# EAGLE design sensnode (EAGLE 5.11)
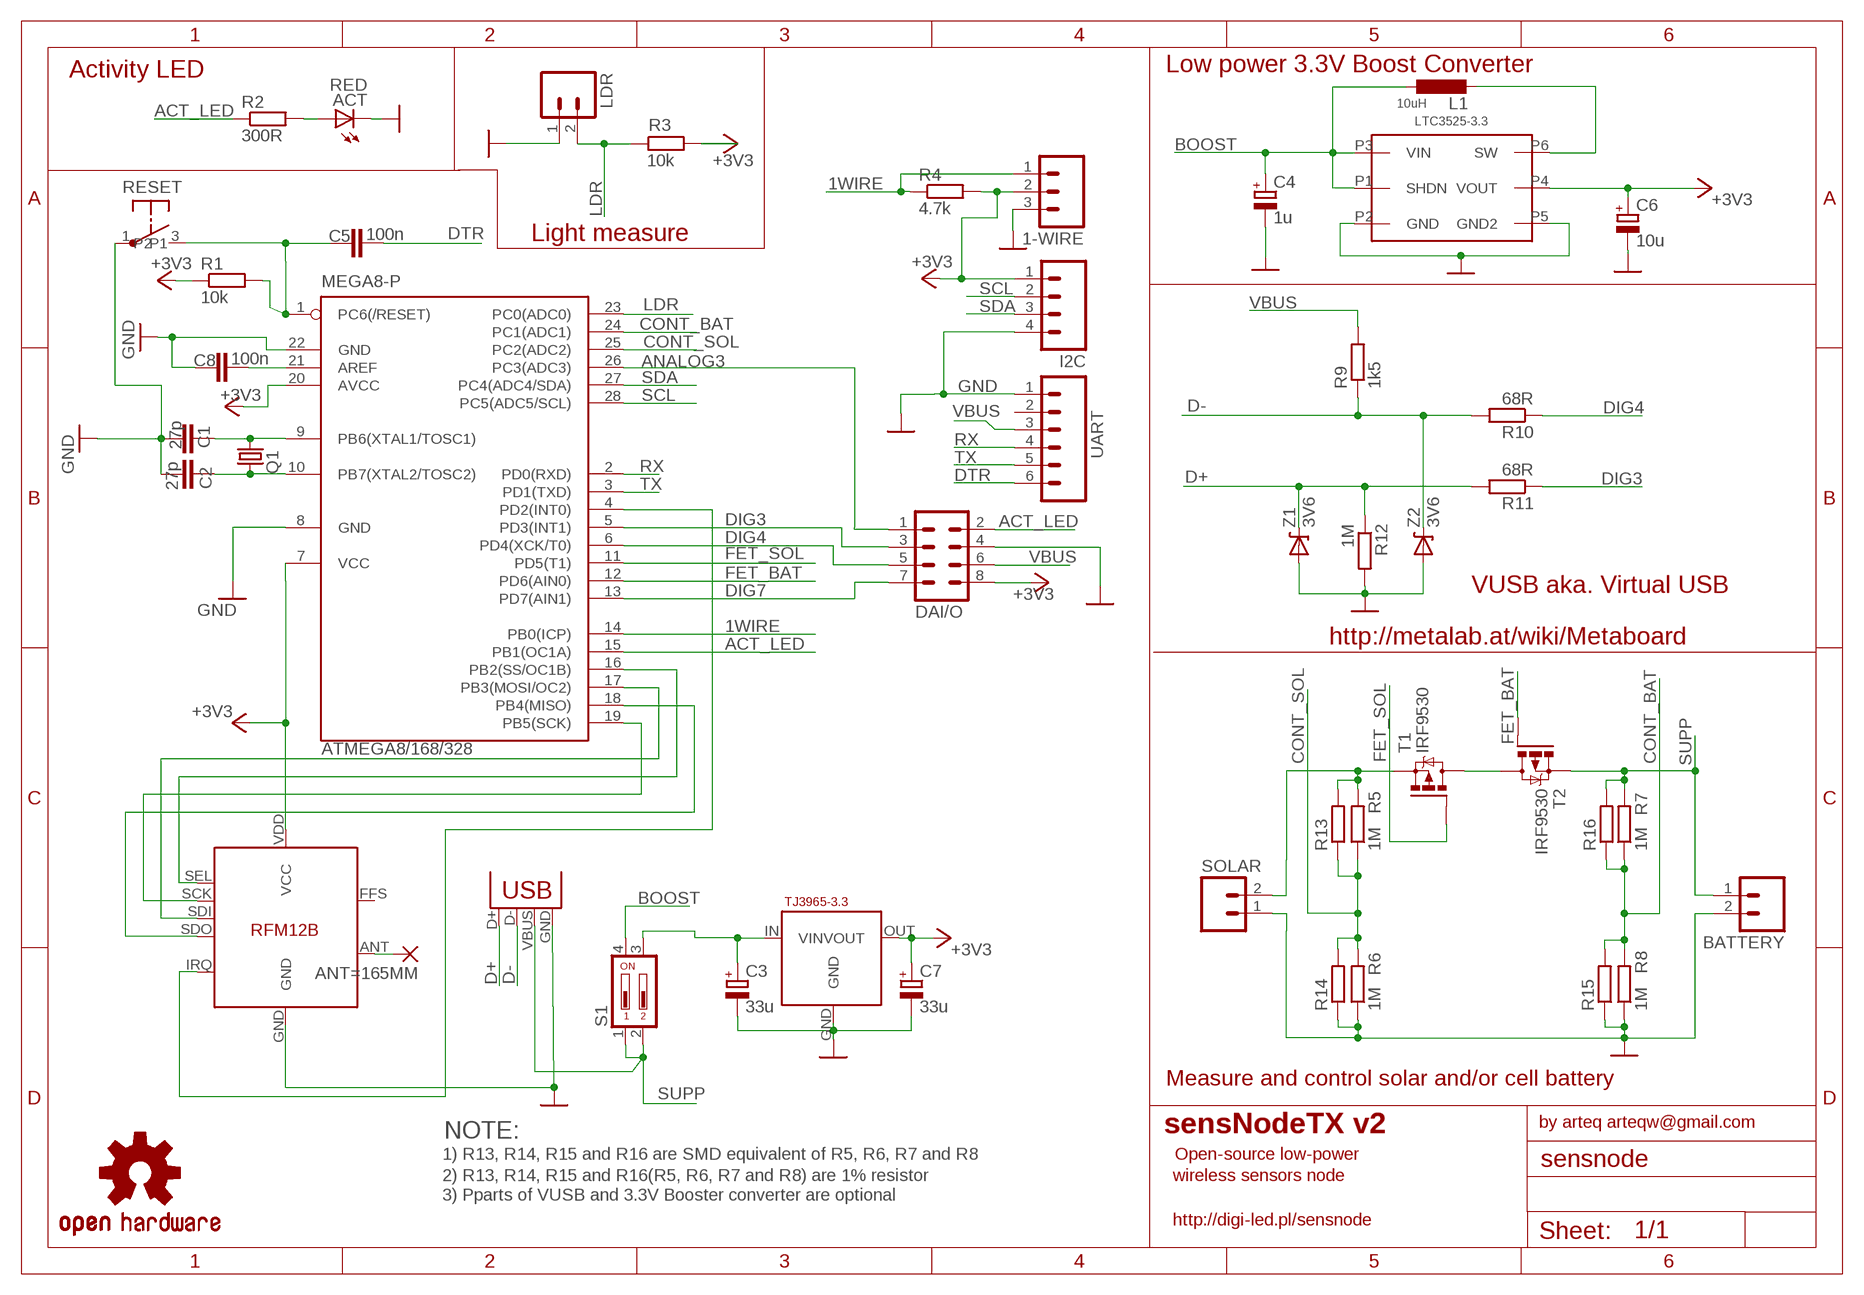
[diagram p0: schematic, sheet 1]

## Parts
1-WIRE  M03PTH  [1X03]
3.3V  TJ3965-3.3  [SOT223]
ACT  RED  LED3MM  [LED3MM]
ANT=165MM  1,6/0,8  [1,6/0,8]
ATMEGA8/168/328  MEGA8-P  [DIL28-3]
BATTERY  M02PTH  [1X02]
C1  27p  C2.5/2  [C2.5-2]
C2  27p  C2.5/2  [C2.5-2]
C3  33u  CPOL-EUSMCB  [SMC_B]
C4  1u  CPOL-EUSMCA  [SMC_A]
C5  100n  C2.5/2  [C2.5-2]
C6  10u  CPOL-EUSMCA  [SMC_A]
C7  33u  CPOL-EUSMCB  [SMC_B]
C8  100n  C2.5/2  [C2.5-2]
I2C  M04PTH  [1X04]
L1  L-EU0207/10  [0207/10]
LDR  M02PTH  [1X02]
Q1  CRYSTALHC49U70  [HC49U70]
R1  10k  R-EU_0204/7  [0204/7]
R2  300R  R-EU_0204/7  [0204/7]
R3  10k  R-EU_0204/7  [0204/7]
R4  4.7k  R-EU_0204/7  [0204/7]
R5  1M  R-EU_0204/7  [0204/7]
R6  1M  R-EU_0204/7  [0204/7]
R7  1M  R-EU_0204/7  [0204/7]
R8  1M  R-EU_0204/7  [0204/7]
R9  1k5  R-EU_0204/7  [0204/7]
R10  68R  R-EU_0204/7  [0204/7]
R11  68R  R-EU_0204/7  [0204/7]
R12  1M  R-EU_0204/7  [0204/7]
R13  R-EU_M0805  [M0805]
R14  R-EU_M0805  [M0805]
R15  R-EU_M0805  [M0805]
R16  R-EU_M0805  [M0805]
RESET  TACT3X6  [TACK3X6]
RFM12B  RFM12B  [RFM12B]
S1  DIP02YL  [DIP02YL]
SOLAR  M02PTH  [1X02]
T1  IRF9530  [TO220BV]
T2  IRF9530  [TO220BV]
U$1  M04X2  [2X4]
U$2  LTC3525  [6-LEAD-SC70]
U$3  OSHW-LOGOM  [OSHW-LOGO-M]
UART  M06SIP  [1X06]
USB_PWR  USBSMD  [USB-MINIB]
Z1  3V6  DIODE-ZENERPTH  [DIODE-ZENER]
Z2  3V6  DIODE-ZENERPTH  [DIODE-ZENER]

## Nets
1WIRE: 1-WIRE.1 ATMEGA8/168/328.14(PB0(ICP)) R4.1
+3V3: 1-WIRE.2 3.3V.OUT(VOUT) ATMEGA8/168/328.7(VCC) ATMEGA8/168/328.20(AVCC) C6.+ C7.+ I2C.1 R1.1 R3.2 R4.2 RFM12B.VDD(VCC) U$1.8 U$2.P4(VOUT)
ACT_LED: ATMEGA8/168/328.15(PB1(OC1A)) R2.1 U$1.2
ANALOG3: ATMEGA8/168/328.26(PC3(ADC3)) U$1.1
BOOST: C4.+ L1.1 S1.4 U$2.P1(SHDN) U$2.P3(VIN)
CONT_BAT: ATMEGA8/168/328.24(PC1(ADC1)) R7.1 R8.2 R15.2 R16.1
CONT_SOL: ATMEGA8/168/328.25(PC2(ADC2)) R5.1 R6.2 R13.1 R14.2
D+: R11.2 R12.1 USB_PWR.D+ Z1.P$1(C)
D-: R9.1 R10.2 USB_PWR.D- Z2.P$1(C)
DIG3: ATMEGA8/168/328.5(PD3(INT1)) R11.1 U$1.3
DIG4: ATMEGA8/168/328.6(PD4(XCK/T0)) R10.1 U$1.5
DIG7: ATMEGA8/168/328.13(PD7(AIN1)) U$1.7
DTR: C5.1 UART.6
FET_BAT: ATMEGA8/168/328.12(PD6(AIN0)) T2.G
FET_SOL: ATMEGA8/168/328.11(PD5(T1)) T1.G
GND: 1-WIRE.3 3.3V.GND ACT.K(C) ATMEGA8/168/328.8(GND) ATMEGA8/168/328.22(GND) BATTERY.2 C3.- C4.- C6.- C7.- C8.2 I2C.4 LDR.1 R6.1 R8.1 R12.2 R14.1 R15.1 RFM12B.GND SOLAR.1 U$1.4 U$2.P2(GND) U$2.P5(GND2) UART.1 USB_PWR.GND Z1.P$2(A) Z2.P$2(A)
LDR: ATMEGA8/168/328.23(PC0(ADC0)) LDR.2 R3.1
N$1: ATMEGA8/168/328.10(PB7(XTAL2/TOSC2)) C2.1 Q1.1
N$2: ATMEGA8/168/328.9(PB6(XTAL1/TOSC1)) C1.1 Q1.2
N$3: ATMEGA8/168/328.4(PD2(INT0)) RFM12B.IRQ
N$4: ATMEGA8/168/328.21(AREF) C8.1
N$5: ATMEGA8/168/328.19(PB5(SCK)) RFM12B.SCK
N$8: ACT.A R2.2
N$10: L1.2 U$2.P6(SW)
N$12: R5.2 R13.2 SOLAR.2 T1.S
N$13: T1.D T2.D
N$17: ATMEGA8/168/328.18(PB4(MISO)) RFM12B.SDO
N$24: ANT=165MM.1(P) RFM12B.ANT
N$27: 3.3V.IN(VIN) C3.+ S1.3
N$29: ATMEGA8/168/328.17(PB3(MOSI/OC2)) RFM12B.SDI
N$30: ATMEGA8/168/328.16(PB2(SS/OC1B)) RFM12B.SEL
P1: C1.2 C2.2 RESET.1 ; supply symbol labelled GND
P2: ATMEGA8/168/328.1(PC6(/RESET)) C5.2 R1.2 RESET.3(P2)
RX: ATMEGA8/168/328.2(PD0(RXD)) UART.4
SCL: ATMEGA8/168/328.28(PC5(ADC5/SCL)) I2C.2
SDA: ATMEGA8/168/328.27(PC4(ADC4/SDA)) I2C.3
SUPP: BATTERY.1 R7.2 R16.2 S1.1 S1.2 T2.S USB_PWR.VBUS
TX: ATMEGA8/168/328.3(PD1(TXD)) UART.5
VBUS: R9.2 U$1.6 UART.3
Unconnected: RFM12B.FFS UART.2

## Notes on the sheet
- Activity LED | Low power 3.3V Boost Converter
- 10uH
- LTC3525-3.3
- Light measure
- VUSB aka. Virtual USB
- DAI/O
- http://metalab.at/wiki/Metaboard
- Measure and control solar and/or cell battery
- by arteq arteqw@gmail.com
- NOTE: | sensNodeTX v2
- 1) R13, R14, R15 and R16 are SMD equivalent of R5, R6, R7 and R8 | Open-source low-power
- 2) R13, R14, R15 and R16(R5, R6, R7 and R8) are 1% resistor | wireless sensors node
- 3) Pparts of VUSB and 3.3V Booster converter are optional
- http://digi-led.pl/sensnode

## Library data of the parts
1-WIRE = SparkFun:M03: Header 3 Standard 3-pin 0.1" header. Use with straight break away headers (SKU : PRT-00116), right angle break away headers (PRT-00553), swiss pins (PRT-00743), machine pins (PRT-00117), and female headers (PRT-00115). Molex polarized connector foot print use with SKU : PRT-08232 with associated crimp pins and housings.
3.3V = artek:TJ3965-3.3: Stabilizator TJ3965S-3.3 firmy HTC
ACT = adafruit:LED: LED OSRAM: - CHIPLED LG R971, LG N971, LY N971, LG Q971, LY Q971, LO R971, LY R971 LH N974, LH R974 LS Q976, LO Q976, LY Q976 LO Q996 - Hyper CHIPLED LW Q18S LB Q993, LB Q99A, LB R99A - SideLED LS A670, LO A670, LY A670, LG A670, LP A670 LB A673, LV A673, LT A673, LW A673 LH A674 LY A675 LS A676, LA A676, LO A676, LY A676, LW A676 LS A679, LY A679, LG A679 - Hyper Micro SIDELED® LS Y876, LA Y876, LO Y876, LY Y876 LT Y87S - SmartLED LW L88C, LW L88S LB L89C, LB L89S, LG L890 LS L89K, LO L89K, LY L89K LS L896, LA L896, LO L896, LY L896 - TOPLED LS T670, LO T670, LY T670, LG T670, LP T670 LSG T670, LSP T670, LSY T670, LOP T670, LYG T670 LG T671, LOG T671, LSG T671 LB T673, LV T673, LT T673, LW T673 LH T674 LS T676, LA T676, LO T676, LY T676, LB T676, LH T676, LSB T676, LW T676 LB T67C, LV T67C, LT T67C, LS T67K, LO T67K, LY T67K, LW E67C LS E67B, LA E67B, LO E67B, LY E67B, LB E67C, LV E67C, LT E67C LW T67C LS T679, LY T679, LG T679 LS T770, LO T770, LY T770, LG T770, LP T770 LB T773, LV T773, LT T773, LW T773 LH T774 LS E675, LA E675, LY E675, LS T675 LS T776, LA T776, LO T776, LY T776, LB T776 LHGB T686 LT T68C, LB T68C - Hyper Mini TOPLED® LB M676 - Mini TOPLED Santana® LG M470 LS M47K, LO M47K, LY M47K Source: http://www.osram.convergy.de/
ANT=165MM = wirepad:1,6/0,8: THROUGH-HOLE PAD
ATMEGA8/168/328 = atmel:MEGA8-P: MICROCONTROLLER 8 Kbytes FLASH, 1 kbytes SRAM, 512 bytes EEPROM, USART, 4-channel 10 bit ADC, 2-channel 8 bit ADC Pin compatible with Atmega48, ATMega88, ATMega168 Source: avr.lbr
BATTERY LDR SOLAR = SparkFun:M02: Header 2 Standard 2-pin 0.1" header. Use with straight break away headers (SKU : PRT-00116), right angle break away headers (PRT-00553), swiss pins (PRT-00743), machine pins (PRT-00117), and female headers (PRT-00115). Molex polarized connector foot print use with SKU : PRT-08233 with associated crimp pins and housings.
C1 C2 C5 C8 = capacitor-wima:C: CAPACITOR naming: grid - package width
C3 C4 C6 C7 = resistor:CPOL-EU: POLARIZED CAPACITOR, European symbol
I2C = SparkFun:M04: Header 4 Standard 4-pin 0.1" header. Use with straight break away headers (SKU : PRT-00116), right angle break away headers (PRT-00553), swiss pins (PRT-00743), machine pins (PRT-00117), and female headers (PRT-00115). Molex polarized connector foot print use with SKU : PRT-08231 with associated crimp pins and housings. 1MM SMD Version SKU: PRT-10208
L1 = resistor:L-EU: INDUCTOR, European symbol
Q1 = crystal:CRYSTAL: CRYSTAL
R1-R16 = resistor:R-EU_: RESISTOR, European symbol
RESET = artek:TACT3X6
RFM12B = JeeParts:RFM12B
S1 = switch-dil:DIP02YL: DIL/CODE SWITCH
T1 T2 = transistor-power:IRF9530: P-CHANNEL HEXFET POWER-MOS-FET Source: http://www.irf.com/product-info/datasheets/data/irf9530.pdf
U$1 = SparkFun:M04X2
U$2 = TSlib:LTC3525
U$3 = SparkFun:OSHW-LOGO: Open Source Hardware Logo This logo indicates the piece of hardware it is found on incorporates a OSHW license and/or adheres to the definition of open source hardware found here: http://freedomdefined.org/OSHW
UART = SparkFun:M06: Header 6 Standard 6-pin 0.1" header. Use with straight break away headers (SKU : PRT-00116), right angle break away headers (PRT-00553), swiss pins (PRT-00743), machine pins (PRT-00117), and female headers (PRT-00115). Molex polarized connector foot print use with SKU : PRT-08094 with associated crimp pins and housings. NOTES ON THE VARIANTS LOCK and LOCK_LONGPADS... This footprint was designed to help hold the alignment of a through-hole component (i.e. 6-pin header) while soldering it into place. You may notice that each hole has been shifted either up or down by 0.005 of an inch from it's more standard position (which is a perfectly straight line). This slight alteration caused the pins (the squares in the middle) to touch the edges of the holes. Because they are alternating, it causes a "brace" to hold the component in place. 0.005 has proven to be the perfect amount of "off-center" position when using our standard breakaway headers. Although looks a little odd when you look at the bare footprint, once you have a header in there, the alteration is very hard to notice. Also, if you push a header all the way into place, it is covered up entirely on the bottom side. This idea of altering the position of holes to aid alignment will be further integrated into the Sparkfun Library for other footprints. It can help hold any component with 3 or more connection pins.
USB_PWR = SparkFun:USB: USB Connectors USB-B-PTH is fully proven SKU : PRT-00139 USB-miniB is fully proven SKU : PRT-00587 USB-A-PCB is untested. USB-A-H is throughly reviewed, but untested. Spark Fun Electronics SKU : PRT-00437 USB-B-SMT is throughly reviewed, but untested. Needs silkscreen touching up. USB-A-S has not been used/tested USB-MB-H has not been used/tested
Z1 Z2 = SparkFun:DIODE-ZENER: Zener Diode Production Part - 8199 3.4V Zener Voltage

## Board
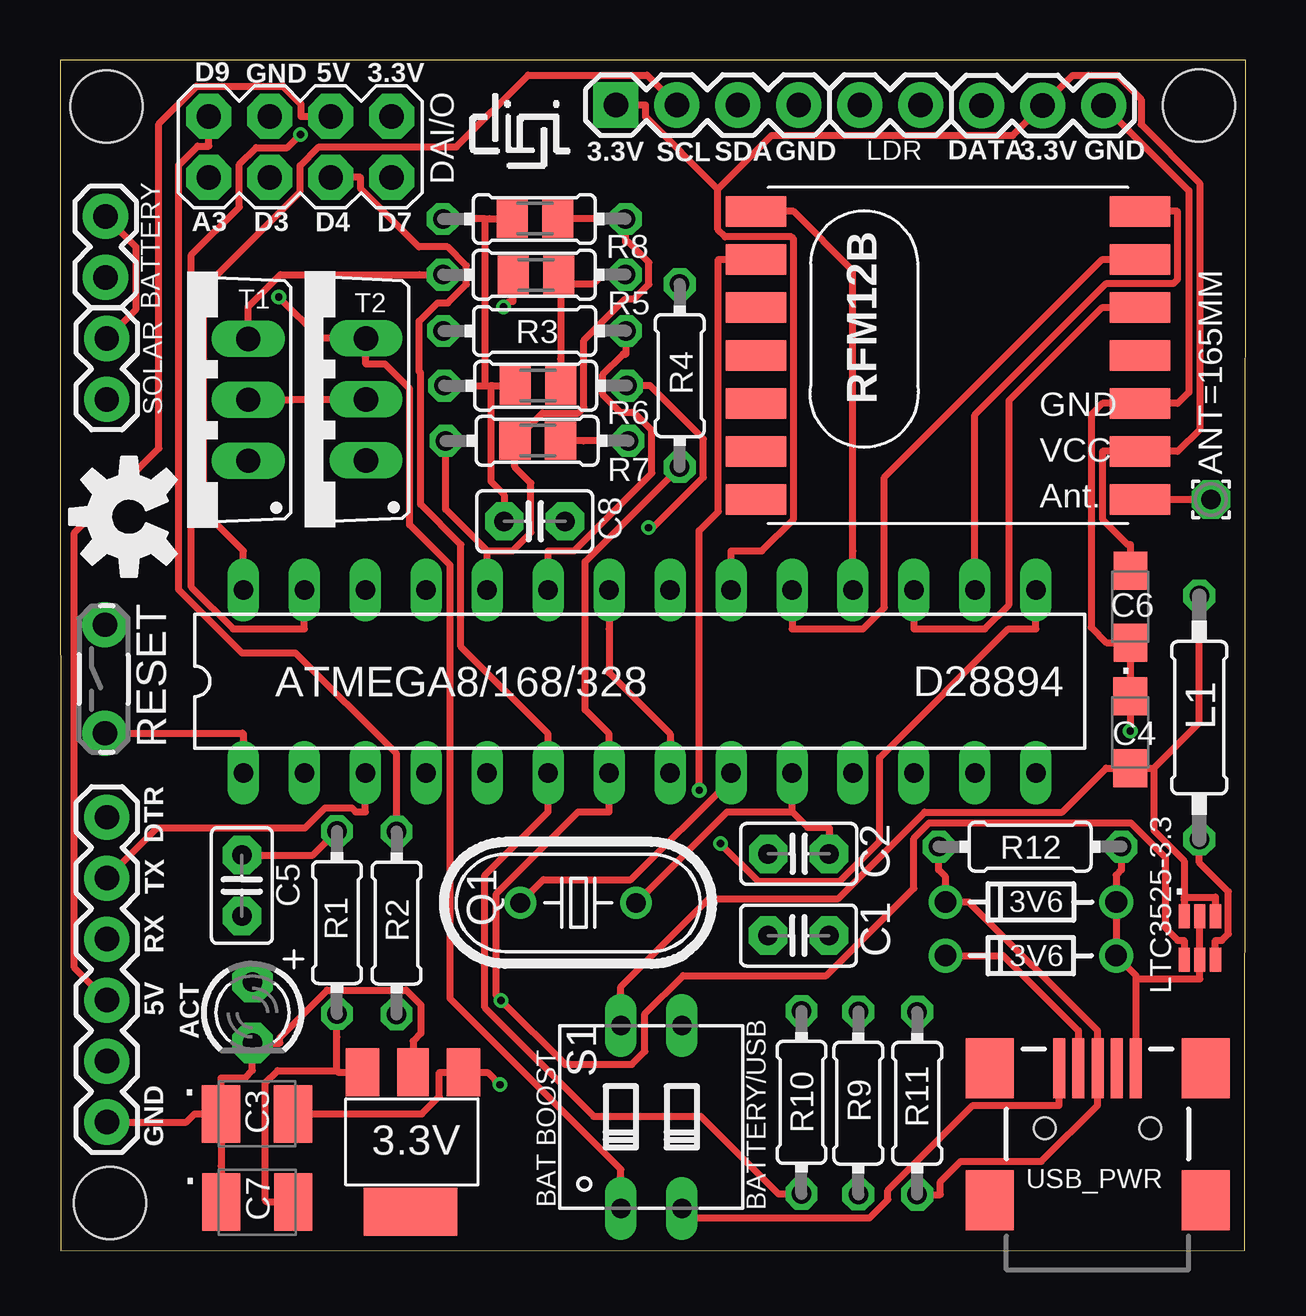
[diagram p1: board, top side]
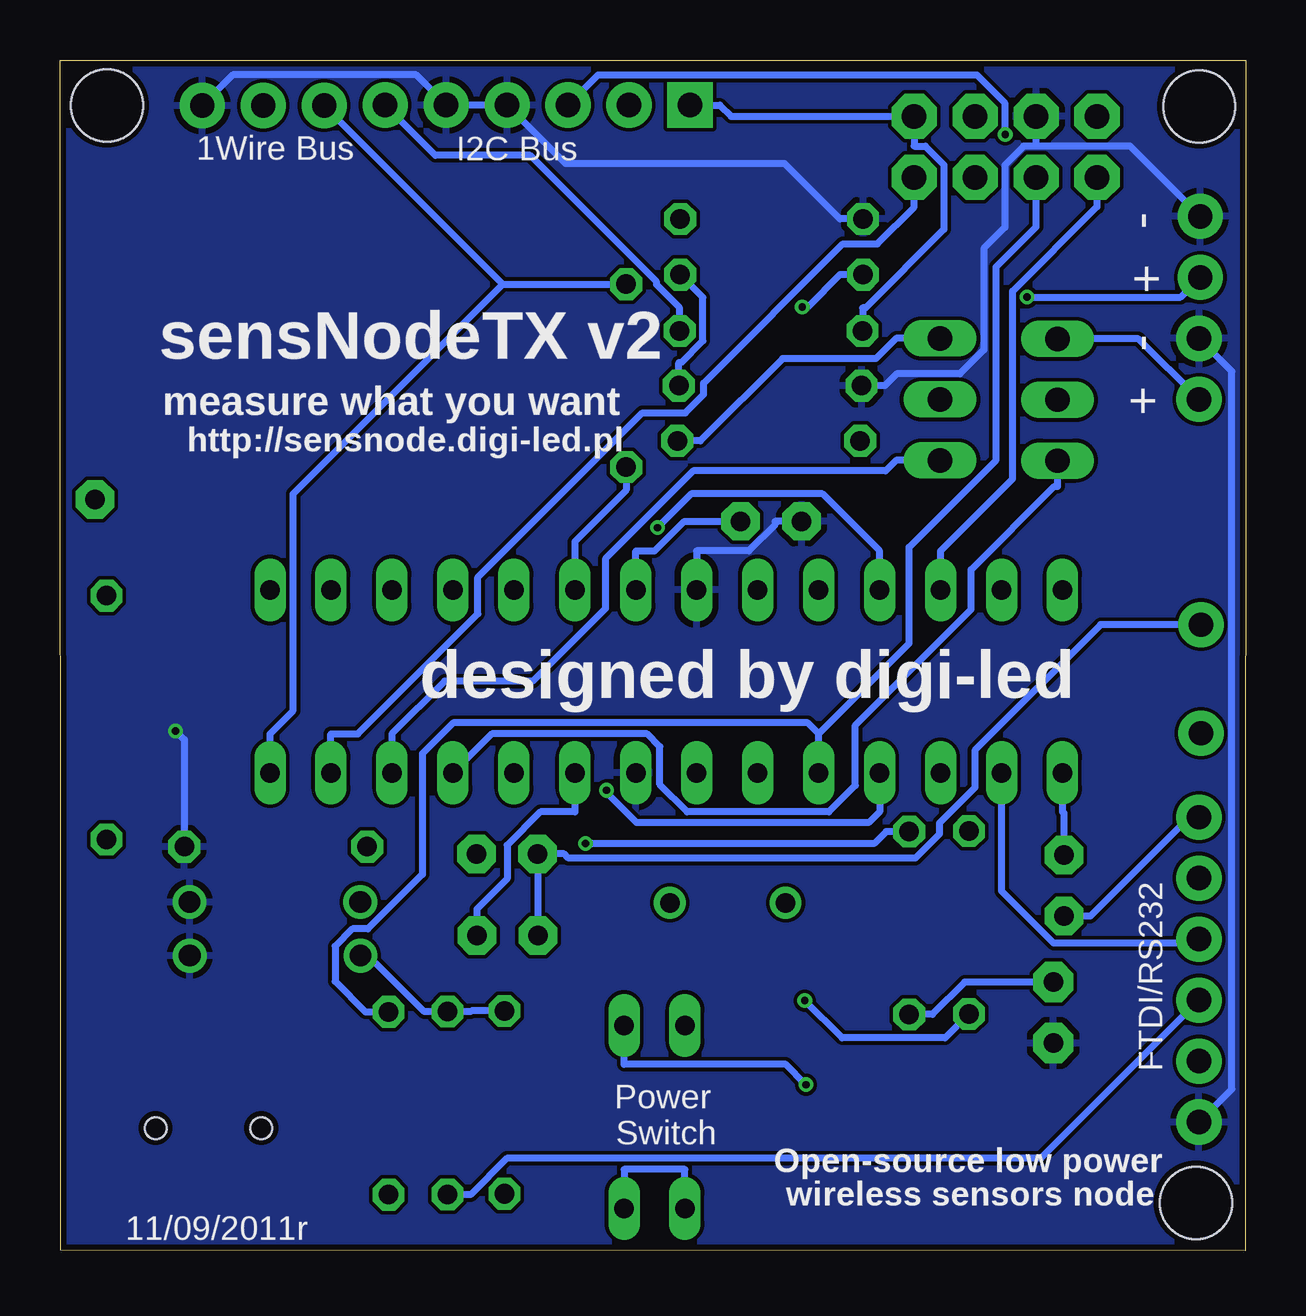
[diagram p2: board, bottom side, seen from below]

Size 49.41 x 49.61 mm. Coordinates in mm from the lower left corner, seen from the top.
Outline: 0.03,0 49.37,0.02 49.41,49.61 0,49.61 0.03,0
Copper layers (1*16): Top 0.035mm / dielectric 1.5mm / Bottom 0.035mm
Design rules "Fusion_eagle_rule_v1.1": minimum track width 6mil, minimum drill 12mil, track to track 6mil, track to pad 6mil, pad to pad 6mil, via to via 6mil, smd to smd 0mil, copper to edge 10mil, drill to drill 10mil, minimum pad ring 10mil, minimum via ring 6mil, stop-mask expansion 2mil, vias tented up to drill 100mil, thermal gap 10mil
Holes 3 mm at 47.46,47.72 2.08,1.99 1.94,47.68

### Footprints (pad centres in the part's own frame; a part is rotated, then mirrored left to right if it is on the bottom)
1X03 = drill 1.016 pad 1.88 round: 1 0,0; 2 2.54,0; 3 5.08,0
SOT223 = smd 1.3 x 2: GND 0.1,2.8 | smd 1.4 x 2: IN 2.2,2.8; OUT -2,2.8 | smd 3.9 x 2: NONE 0,-3
LED3MM = drill 0.813 pad 1.676 octagon: A -1.27,0; K 1.27,0
1,6/0,8 = drill 0.813 pad 1.6 octagon: 1 0,0
DIL28-3 = drill 0.813 long: 1 -16.51,-3.81; 2 -13.97,-3.81; 3 -11.43,-3.81; 4 -8.89,-3.81; 5 -6.35,-3.81; 6 -3.81,-3.81; 7 -1.27,-3.81; 8 1.27,-3.81; 9 3.81,-3.81; 10 6.35,-3.81; 11 8.89,-3.81; 12 11.43,-3.81; 13 13.97,-3.81; 14 16.51,-3.81; 15 16.51,3.81; 16 13.97,3.81; 17 11.43,3.81; 18 8.89,3.81; 19 6.35,3.81; 20 3.81,3.81; 21 1.27,3.81; 22 -1.27,3.81; 23 -3.81,3.81; 24 -6.35,3.81; 25 -8.89,3.81; 26 -11.43,3.81; 27 -13.97,3.81; 28 -16.51,3.81
1X02 = drill 1.016 pad 1.88 round: 1 0,0; 2 2.54,0
C2.5-2 = drill 0.813 pad 1.6 octagon: 1 -1.27,0; 2 1.27,0
SMC_B = smd 1.6 x 2.4: + -1.5,0; - 1.5,0
SMC_A = smd 1.6 x 1.4: + -1.5,0; - 1.5,0
1X04 = drill 1.016 pad 1.88 square: 1 0,0 | drill 1.016 pad 1.88 round: 2 2.54,0; 3 5.08,0; 4 7.62,0
0207/10 = drill 0.813 octagon: 1 -5.08,0; 2 5.08,0
HC49U70 = drill 0.813 round: 1 -2.413,0; 2 2.413,0
0204/7 = drill 0.813 octagon: 1 -3.81,0; 2 3.81,0
M0805 = smd 1.3 x 1.6: 1 -0.95,0; 2 0.95,0
TACK3X6 = drill 1.016 pad 1.88 round: 1 -1.981,2.261; 3 -1.981,-2.261
RFM12B = smd 2.54 x 1.27: ANT 8,-6; FFS -8,2; GND 8,-2; IRQ -8,4; P$8 -8,0; P$9 -8,-2; P$10 -8,-4; P$12 -8,-6; P$16 8,0; SCK 8,4; SDI 8,2; SDO -8,6; SEL 8,6; VDD 8,-4
DIP02YL = drill 0.813 long: 1 -1.27,-3.81; 2 1.27,-3.81; 3 1.27,3.81; 4 -1.27,3.81
TO220BV = drill 1.016 long: D 0,-2.54; G -2.54,-2.54; S 2.54,-2.54
2X4 = drill 1.016 pad 1.88 octagon: 1 -3.81,-1.27; 2 -3.81,1.27; 3 -1.27,-1.27; 4 -1.27,1.27; 5 1.27,-1.27; 6 1.27,1.27; 7 3.81,-1.27; 8 3.81,1.27
6-LEAD-SC70 = smd 0.47 x 1: P1 -0.65,0; P2 0,0; P3 0.65,0; P4 0.65,1.8; P5 0,1.8; P6 -0.65,1.8
1X06 = drill 1.016 pad 1.88 round: 1 0,0; 2 2.54,0; 3 5.08,0; 4 7.62,0; 5 10.16,0; 6 12.7,0
USB-MINIB = smd 2.5 x 0.5: D+ 2.5,0; D- 2.5,0.8; GND 2.5,-1.6; ID 2.5,-0.8; VBUS 2.5,1.6 | smd 2.5 x 2: MTN1 -3,4.5; MTN2 2.5,4.5; MTN3 -3,-4.5; MTN4 2.5,-4.5 | hole 0.9: 0,2.2; 0,-2.2
DIODE-ZENER = drill 0.9 round: P$1 -3.556,0; P$2 3.556,0

### Placement (x,y rotation side)
1-WIRE  38.4,47.71 0 top
3.3V  14.61,4.63 0 top
ACT  8.02,9.92 270 top
ANT=165MM  47.95,31.3 0 top
ATMEGA8/168/328  24.15,23.72 0 top
BATTERY  1.9,40.55 90 top
C1  30.77,13.13 180 top
C2  30.78,16.53 180 top
C3  8.21,5.7 180 top
C4  44.59,21.6 90 top
C5  7.58,15.21 90 top
C6  44.6,26.83 270 top
C7  8.22,2.02 180 top
C8  19.78,30.39 180 top
I2C  23.16,47.73 0 top
L1  47.47,22.21 270 top
LDR  33.32,47.73 0 top
Q1  21.59,14.49 180 top
R1  11.54,13.67 90 top
R2  14.03,13.65 270 top
R3  19.78,38.32 180 top
R4  25.82,36.46 270 top
R5  19.76,40.66 180 top
R6  19.82,36.04 0 top
R7  19.88,33.74 0 top
R8  19.76,42.99 0 top
R9  33.26,6.15 270 top
R10  30.89,6.18 90 top
R11  35.72,6.14 270 top
R12  40.42,16.83 0 top
R13  19.83,40.66 180 top
R14  19.91,36.04 0 top
R15  19.79,43 0 top
R16  19.91,33.75 0 top
RESET  3.85,23.82 0 top
RFM12B  37,37.3 0 top
S1  24.64,5.57 0 top
SOLAR  1.95,38.01 270 top
T1  5.3,35.45 90 top
T2  10.2,35.47 90 top
U$1  10.01,45.99 0 top
U$2  47.49,13.93 180 top
U$3  2.88,30.58 90 top
UART  1.95,5.36 90 top
USB_PWR  43.23,5.11 90 top
Z1  40.45,14.53 0 top
Z2  40.45,12.29 0 top

### Tracks (layer width: path | path; a pad name or v marks a point on that pad's centre or on a via)
1WIRE
  Bottom 0.3: ATMEGA8/168/328.14 40.66,21.53 39.7,22.5 39.7,31.53 30.96,40.27 | 30.96,40.27 1-WIRE.1 | 30.96,40.27 R4.1
+3V3  (via drill 0.3 pad 0.61)
  Top 0.3: 11.54,7.5 11.54,8.9 R1.1 | 11.54,7.5 11.61,7.43 3.3V.OUT | 11.54,7.5 9.07,7.5 8.56,6.99 8.56,2.08 8.62,2.02 C7.+ | 27.41,44.23 29.65,46.47 39.7,46.47 1-WIRE.2 42.2,48.97 44.04,48.97 45.04,47.97 45.04,46.93 47.49,44.48 47.49,34.21 46.57,33.3 RFM12B.VDD 43.43,33.3 43.43,30.48 44.47,29.43 44.6,29.43 C6.+ | U$2.P4 46.84,12.93 46.57,12.93 46.05,13.45 46.05,16.39 44.62,17.82 36.22,17.82 35.57,17.18 35.57,15.1 31.94,11.46 25.96,11.46 24.37,9.87 24.37,8.3 23.83,7.76 21.04,7.76 v18.38,10.42 18.18,10.62 18.18,14.87 21.59,18.29 22.88,18.29 ATMEGA8/168/328.7 22.88,21.53 21.88,22.54 21.88,28.71 R4.2 | I2C.1 24.4,47.73 24.4,47.24 27.41,44.23 | 27.41,44.23 27.41,42.54 27.71,42.24 30.48,42.24 30.57,42.15 30.57,30.48 29.25,29.15 27.96,29.15 ATMEGA8/168/328.20
  Bottom 0.3: R1.1 12.53,8.87 16.83,8.87 v18.38,10.42 | R3.2 15.97,39.28 15.84,39.28 12.58,42.55 12.58,45.24 13.35,46.02 13.82,46.02 U$1.8 21.45,47.26 21.92,47.73 I2C.1 | R4.2 25.82,31.68 27.96,29.55 27.96,29.15 ATMEGA8/168/328.20
ACT_LED  (via drill 0.3 pad 0.61)
  Top 0.3: R2.1 14.02,20.7 9.82,24.9 7.59,24.9 4.95,27.54 4.95,45.23 5.73,46.02 6.2,46.02 U$1.2 | ATMEGA8/168/328.15 40.66,25.91 39.52,25.91 34.15,20.54 34.15,17.05 32.49,15.39 29.09,15.39 v27.52,16.96
  Bottom 0.3: R2.1 14.99,17.46 15.49,16.96 v27.52,16.96
ANALOG3
  Bottom 0.3: ATMEGA8/168/328.26 12.72,29.15 9.72,32.15 9.72,39.98 6.23,43.48 6.2,43.48 U$1.1
BOOST
  Top 0.3: 45.58,20.1 47.47,21.99 47.47,26.33 L1.1 | 45.58,20.1 C4.+ 43.59,20.1 41.77,18.27 36.03,18.27 32.42,14.66 | 46.84,14.73 46.84,16.24 45.58,17.51 45.58,20.1 | 46.84,14.73 46.84,14.62 U$2.P3 | U$2.P1 48.14,14.73 46.84,14.73 | 32.42,14.66 | 32.42,14.66 27.03,14.66 23.37,11 S1.4
CONT_BAT
  Top 0.3: 17.8,29.15 18.86,29.15 19.62,29.92 19.62,31.98 18.96,32.64 R16.1 20.1,34.89 21.6,34.89 21.83,35.12 21.83,37.93 23.56,39.66 23.93,39.66 24.53,40.26 24.53,41.18 23.69,42.02 23.57,42.02 R8.2 22.61,42.99 22.6,43 R15.2 | R7.1 16.07,30.89 17.8,29.15 | ATMEGA8/168/328.24 17.8,29.15
CONT_SOL  (via drill 0.3 pad 0.61)
  Top 0.3: R6.2 24.59,36.04 26.81,33.82 26.81,32.22 24.71,30.12 v24.52,30.12 | 20.86,40.27 22.21,40.27 22.61,40.66 R5.1 | R13.1 20.78,40.35 20.86,40.27 | 20.86,40.27 20.86,37.14 R14.2
  Bottom 0.3: ATMEGA8/168/328.25 15.26,29.15 17.64,31.53 23.12,31.53 v24.52,30.12 | R6.2 23.63,37 23.53,37 22.62,37.91 22.62,39.72 R5.1
D+
  Top 0.3: R12.1 36.61,15.87 36.9,15.58 Z1.P$1 37.87,14.53 43.23,9.16 USB_PWR.D+ 43.23,6.06 40.89,3.72 37.53,3.72 36.68,2.87 36.68,2.33 R11.2
D-
  Top 0.3: USB_PWR.D- 42.43,9.16 39.3,12.29 Z2.P$1
  Bottom 0.3: R10.2 32.27,9.99 32.3,9.96 R9.1 34.23,9.96 36.56,12.29 Z2.P$1
DIG3
  Bottom 0.3: U$1.3 8.74,42.66 10.41,40.99 10.41,32.94 14.03,29.32 14.03,25.3 17.8,21.53 | 17.8,21.53 18.25,21.99 33.04,21.99 34.31,20.71 34.31,15.68 36.58,13.41 37.22,13.41 37.95,12.69 37.95,11.22 36.68,9.95 R11.1 | ATMEGA8/168/328.5 17.8,21.53
DIG4
  Top 0.3: U$1.5 12.52,44.72 12.52,44.25 14.95,41.82 16.15,41.82 16.93,41.05 16.93,40.26 16.16,39.49 15.73,39.49 14.97,38.73 14.97,36.64 15.02,36.58 15.02,31.09 16.71,29.41 16.71,25.17 20.34,21.53 ATMEGA8/168/328.6 20.34,18.29 17.7,15.65 17.7,10.13 22.23,5.6 26.71,5.6 29.93,2.37 R10.1
DIG7
  Bottom 0.3: ATMEGA8/168/328.13 38.12,21.53 37,21.53 31.99,26.53 31.99,28.06 25.15,34.91 23.36,34.91 22.59,35.67 22.59,36.15 16.79,41.95 15.35,41.95 13.82,43.48 U$1.7
DTR
  Bottom 0.3: C5.1 6.48,13.94 2.36,18.06 UART.6
FET_BAT
  Bottom 0.3: ATMEGA8/168/328.12 35.58,21.53 33.38,23.73 29.7,23.73 26.69,26.75 26.69,28.82 23.03,32.49 15.01,32.49 14.57,32.93 T2.G
FET_SOL
  Bottom 0.3: T1.G 7.84,31.85 7.98,31.85 11.45,28.37 11.45,26.72 16.27,21.9 16.27,19.39 17.37,18.29 23.28,18.29 24.42,19.42 24.42,21 24.94,21.53 31.42,21.53 ATMEGA8/168/328.11
GND  (via drill 0.3 pad 0.61)
  Top 0.3: C7.- 6.72,3.52 6.71,3.53 C3.- | C3.- 5.61,5.7 5.27,5.36 UART.1 | BATTERY.2 3.17,41.82 3.17,39.23 SOLAR.1 | 1-WIRE.3 47.03,44.16 47.03,35.76 46.57,35.3 RFM12B.GND 43.43,35.3 42.96,34.83 42.96,25.97 43.6,25.33 C6.- 44.6,24.21 44.59,24.2 C4.- 44.59,22 v44.59,21.65 | 17.72,42.99 R8.1 | ATMEGA8/168/328.8 25.42,21.53 22.88,24.07 22.88,25.91 ATMEGA8/168/328.22 | 17.72,42.99 17.88,42.99 17.89,43 R15.1 | 17.72,36.04 17.72,42.99 | 17.72,36.04 17.95,36.04 | 17.72,36.04 16.97,36.04 R6.1 | 17.95,36.04 18.01,36.04 R14.1 | 17.95,36.04 17.95,32.05 18.51,31.49 C8.2 | C3.- 6.71,7.2 7.71,7.2 8.02,7.51 ACT.K 9.16,8.65 9.16,8.88 11.13,10.85 14.42,10.85 15.03,10.24 15.03,9.05 14.71,8.73 3.3V.GND | 44.83,11.33 USB_PWR.GND | 44.83,11.33 44.83,11.47 Z2.P$2 Z1.P$2 44.01,15.65 44.23,15.87 R12.2 | 44.83,11.33 47.49,11.33 U$2.P5 U$2.P2
  Bottom 0.3: BATTERY.2 4.82,46.02 8.74,46.02 | 8.74,46.02 U$1.4 | R6.1 15.04,36.04 14.55,36.53 11.91,36.53 10.92,37.53 10.92,41.76 10.04,42.64 10.04,45.23 9.25,46.02 8.74,46.02 | 1-WIRE.3 42.21,48.99 34.58,48.99 LDR.1 I2C.4 28.34,45.3 19.22,45.3 16.91,42.99 R8.1 | R12.2 44.23,21.29 v44.59,21.65 | ATMEGA8/168/328.22 22.88,29.15 20.71,29.15 19.61,30.25 19.61,30.39 C8.2 | SOLAR.1 0.58,36.64 0.58,6.73 UART.1
  pour Bottom: 0.18,49.42 0.18,0.22 49.2,0.22 49.2,49.42
LDR
  Top 0.3: ATMEGA8/168/328.23 20.34,29.15 21.42,29.15 24.66,32.4 24.66,34.18 23.92,34.92 23.36,34.92 22.62,35.66 22.62,36.51 23.47,37.36 23.59,37.36 R3.1
  Bottom 0.3: R3.1 23.59,39.28 24.55,40.25 24.55,40.37 29.83,45.64 33.77,45.64 LDR.2
N$1
  Top 0.3: C2.1 32.05,17.63 31.15,17.63 30.5,18.29 | 30.5,18.29 ATMEGA8/168/328.10 | Q1.1 27.8,18.29 30.5,18.29
N$2
  Top 0.3: Q1.2 20.14,15.46 23.79,15.46 27.96,19.62 ATMEGA8/168/328.9
  Bottom 0.3: C1.1 32.04,14.23 30.78,15.49 30.78,16.9 29.39,18.29 27.96,18.29 ATMEGA8/168/328.9
N$3  (via drill 0.3 pad 0.61)
  Top 0.3: v26.63,19.18 26.63,30 27.43,30.8 27.43,41.3 RFM12B.IRQ
  Bottom 0.3: ATMEGA8/168/328.4 15.26,18.29 15.71,17.83 25.39,17.83 26.63,19.08 v26.63,19.18 | v26.63,19.18
N$4
  Bottom 0.3: C8.1 22.15,30.39 23.39,30.39 24.63,29.15 25.42,29.15 ATMEGA8/168/328.21
N$5
  Top 0.3: ATMEGA8/168/328.19 30.5,25.91 33.46,25.91 34.35,26.79 34.35,32.22 43.43,41.3 RFM12B.SCK
N$8
  Bottom 0.3: R2.2 13.06,9.84 11.71,11.19 ACT.A
N$10
  Top 0.3: L1.2 47.47,16.17 48.68,14.96 48.68,13.2 48.41,12.93 48.14,12.93 U$2.P6
N$12  (via drill 0.3 pad 0.61)
  Top 0.3: T1.S 7.84,39.06 7.84,39.32 9.18,40.66 14.99,40.66 R5.2 | R13.2 18.88,39.56 18.72,39.56 v18.48,39.32
  Bottom 0.3: R5.2 16.91,40.66 18.26,39.32 v18.48,39.32 | T1.S 4.48,37.99 SOLAR.2
N$13
  Top 0.3: T1.D 9.67,35.45 9.68,35.47 T2.D
N$17
  Top 0.3: ATMEGA8/168/328.18 33.04,29.15 33.04,40.83 30.57,43.3 RFM12B.SDO
N$24
  Top 0.3: RFM12B.ANT ANT=165MM.1
N$27  (via drill 0.3 pad 0.61)
  Top 0.3: C3.+ 15.08,5.7 15.81,6.43 15.81,7.43 3.3V.IN 17.81,7.43 v18.33,6.92
  Bottom 0.3: S1.3 25.91,7.76 19.17,7.76 v18.33,6.92
N$29
  Top 0.3: ATMEGA8/168/328.17 35.58,25.91 38.54,25.91 39.55,26.92 39.55,35.42 43.43,39.3 RFM12B.SDI
N$30
  Top 0.3: RFM12B.SEL 46.57,43.3 46.57,40.47 46.4,40.3 43.6,40.3 38.12,34.82 ATMEGA8/168/328.16
P1
  Bottom 0.3: 28.96,16.53 29.5,15.99 C1.2 | 28.96,16.53 28.41,16.53 28.23,16.35 13.77,16.35 12.77,17.35 12.77,17.81 11.29,19.29 11.29,20.84 6.05,26.08 RESET.1 | 28.96,16.53 C2.2
P2
  Top 0.3: ATMEGA8/168/328.1 7.64,21.53 7.61,21.56 RESET.3 | R1.2 10.54,16.48 C5.2
  Bottom 0.3: ATMEGA8/168/328.1 7.64,18.29 7.58,18.23 C5.2
RX
  Bottom 0.3: UART.4 2.12,12.81 8.01,12.81 10.18,14.98 ATMEGA8/168/328.2
SCL
  Top 0.3: ATMEGA8/168/328.28 7.64,29.15 5.99,30.81 5.99,40.1 10.01,44.13 10.01,45.21 10.79,45.99 16.52,45.99 19.5,48.98 24.46,48.98 I2C.2
SDA  (via drill 0.3 pad 0.61)
  Top 0.3: v10.03,46.51 9.48,45.96 8.17,45.96 7.47,45.26 7.47,43.48 5.48,41.49 5.48,27.65 7.22,25.91 10.18,25.91 ATMEGA8/168/328.27
  Bottom 0.3: I2C.3 27,48.98 11.2,48.98 10.03,47.8 v10.03,46.51
SUPP  (via drill 0.3 pad 0.61)
  Top 0.3: S1.1 23.37,3.38 16.25,10.5 16.25,28.56 14.57,30.24 14.57,35.91 13.54,36.94 12.74,36.94 T2.S 10.84,38.01 v9.11,39.73 | USB_PWR.VBUS 41.63,6.06 38.03,6.06 34.49,2.51 34.49,2.12 33.73,1.36 26.31,1.36 S1.2 | R7.2 22.72,33.74 21.81,33.74 21.81,33.75 R16.2
  Bottom 0.3: v9.11,39.73 2.72,39.73 BATTERY.1 | S1.1 23.37,3.38 25.91,3.38 S1.2 | T2.S 14.57,38.01 15.41,37.16 19.3,37.16 22.72,33.74 R7.2
TX
  Top 0.3: ATMEGA8/168/328.3 12.72,18.29 12.32,18.29 12.16,18.45 11.05,18.45 10.21,17.61 4.04,17.61 UART.5
VBUS
  Top 0.3: UART.3 0.6,11.79 0.6,29.9 4.12,33.43 4.12,46.95 5.69,48.52 9.29,48.52 10.04,47.77 10.04,47.26 U$1.6
  Bottom 0.3: R9.2 32.3,2.34 30.79,3.85 8.54,3.85 UART.3

### Text on the board
tNames: D9 | GND | 5V | 3.3V | DAI/O | 3.3V | SCL | SDA | GND | DATA | 3.3V | GND | A3 | D3 | D4 | D7 | D28894 | . | DTR | TX | . | RX | LTC3525-3.3 | 5V | . | GND | . | BAT BOOST | BATTERY/USB
bNames: I2C Bus | 1Wire Bus | - | + | sensNodeTX v2 | - | measure what you want | + | http://sensnode.digi-led.pl | designed by digi-led | FTDI/RS232 | Power | Switch | Open-source low power | wireless sensors node | 11/09/2011r